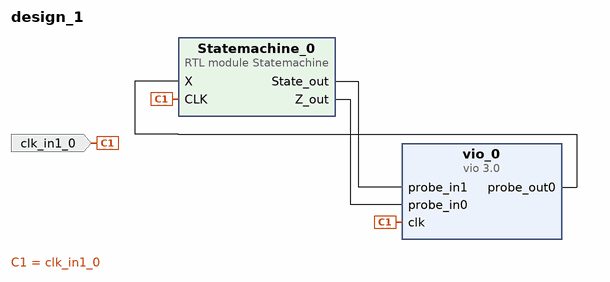
[diagram p0: block diagram of the top level]
# Vivado block design design_1, xc7z020clg400-1, Vivado 2022.1
create_bd_design design_1

create_bd_port -dir I -type clk clk_in1_0

create_bd_cell -type ip -vlnv xilinx.com:ip:vio:3.0 vio_0
set_property -dict {CONFIG.C_EN_PROBE_IN_ACTIVITY 0 CONFIG.C_NUM_PROBE_IN 2} [get_bd_cells vio_0]
create_bd_cell -type module -reference Statemachine Statemachine_0

# ---- connections ----

connect_bd_net [get_bd_pins Statemachine_0/State_out] [get_bd_pins vio_0/probe_in1]
connect_bd_net [get_bd_pins Statemachine_0/Z_out] [get_bd_pins vio_0/probe_in0]
connect_bd_net -net clk_in1_0_1 [get_bd_ports clk_in1_0] [get_bd_pins vio_0/clk] [get_bd_pins Statemachine_0/CLK]
connect_bd_net [get_bd_pins vio_0/probe_out0] [get_bd_pins Statemachine_0/X]

validate_bd_design
save_bd_design
